# EAGLE design untitled (EAGLE 7.2.0)
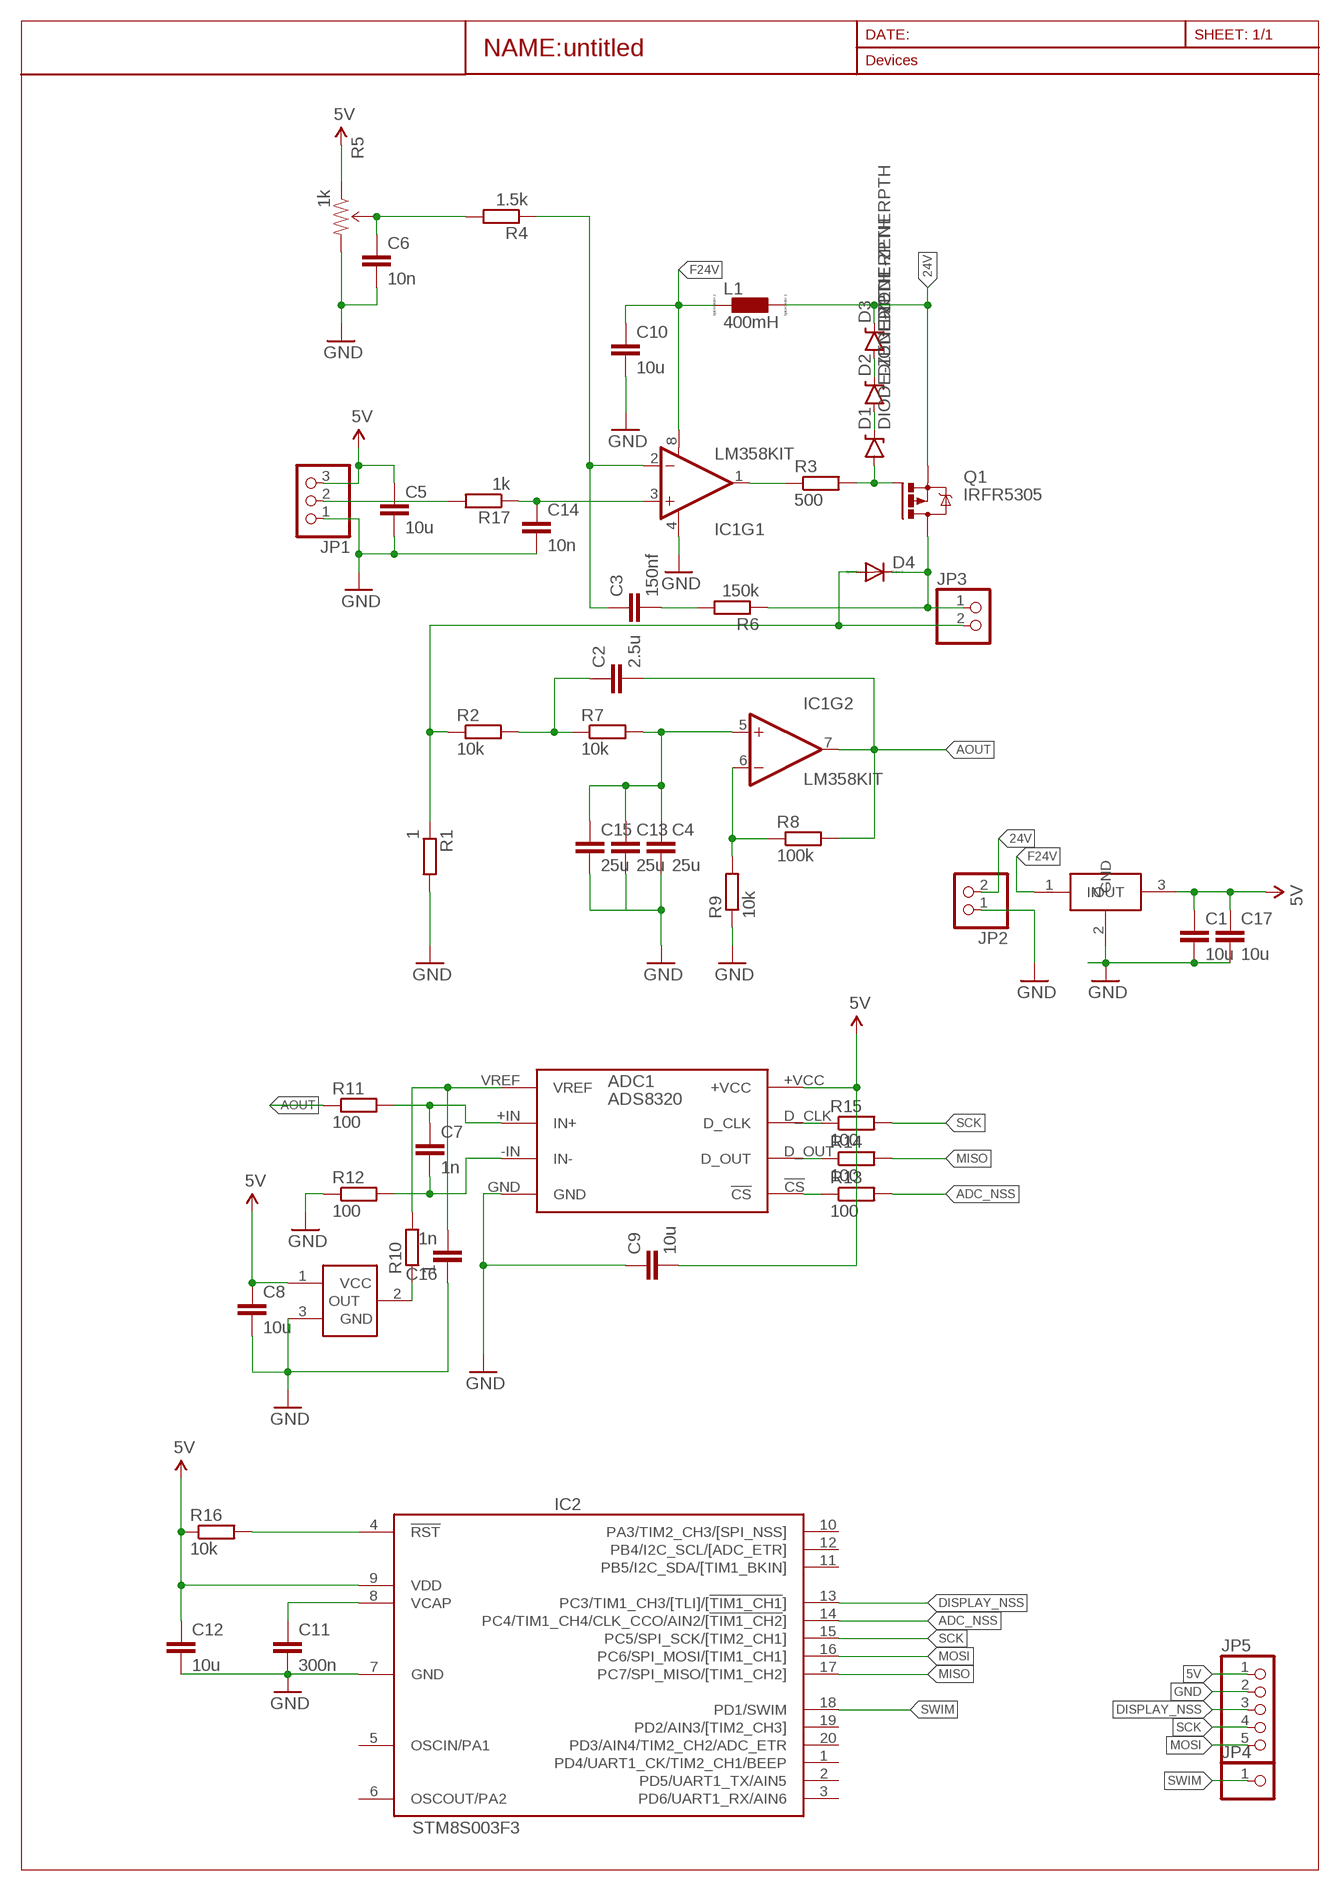
[diagram p0: schematic, sheet 1]

## Parts
ADC1  ADS8320  [S-PDSO-G8]
C1  10u  CC0805  [C0805]
C2  2.5u  CC0805  [C0805]
C3  150nf  CC0805  [C0805]
C4  25u  CC0805  [C0805]
C5  10u  CC0805  [C0805]
C6  10n  CC0805  [C0805]
C7  1n  CC0805  [C0805]
C8  10u  CC0805  [C0805]
C9  10u  CC0805  [C0805]
C10  10u  CC0805  [C0805]
C11  300n  CC0805  [C0805]
C12  10u  CC0805  [C0805]
C13  25u  CC0805  [C0805]
C14  10n  CC0805  [C0805]
C15  25u  CC0805  [C0805]
C16  1n  CC0805  [C0805]
C17  10u  CC0805  [C0805]
D1  DIODE-ZENERPTH  [DIODE-ZENER]
D2  DIODE-ZENERPTH  [DIODE-ZENER]
D3  DIODE-ZENERPTH  [DIODE-ZENER]
D4  DIODE-MINIMELF  [MINIMELF]
IC1  LM358KIT  [DIP08-KIT]
IC2  STM8S003F3  [TSSOP20]
JP1  PINHD-1X3  [1X03]
JP2  PINHD-1X02_2.54  [1X02]
JP3  PINHD-1X02_2.54  [1X02]
JP4  PINHD-1X01_2.54  [1X01]
JP5  PINHD-1X05_2.54  [1X05]
L1  400mH  LL5650M  [L5650M]
Q1  IRFR5305  [D-PAK_TO252AA]
R1  1  R0805  [R0805]
R2  10k  R0805  [R0805]
R3  500  R0805  [R0805]
R4  1.5k  R0805  [R0805]
R5  1k  TRIMPOTTRIMPOT_PTH_S3_LOCK  [TRIMPOT_PTH_S3_LOCK]
R6  150k  R0805  [R0805]
R7  10k  R0805  [R0805]
R8  100k  R0805  [R0805]
R9  10k  R0805  [R0805]
R10  1  R0805  [R0805]
R11  100  R0805  [R0805]
R12  100  R0805  [R0805]
R13  100  R0805  [R0805]
R14  100  R0805  [R0805]
R15  100  R0805  [R0805]
R16  10k  R0805  [R0805]
R17  1k  R0805  [R0805]
U$1  REF3025  [SOT23]
U$2  L7805C2T  [D2PACK]

## Nets
5V: ADC1.+VCC C1.1 C5.1 C8.1 C9.2 C12.1 C17.1 IC2.9(VDD) JP1.3 JP5.1 R5.1(CCW) R16.1 U$1.1(VCC) U$2.3(OUT)
24V: D3.P$1(C) JP2.2 L1.1 Q1.3(S)
ADC_NSS: IC2.14(PC4/TIM1_CH4/CLK_CCO/AIN2/[!TIM1_CH2!]) R13.2
AOUT: C2.2 IC1.7(OUT) R8.2 R11.1
DISPLAY_NSS: IC2.13(PC3/TIM1_CH3/[TLI]/[!TIM1_CH1!]) JP5.3
F24V: C10.1 IC1.8(V+) L1.2 U$2.1(IN)
GND: ADC1.GND C1.2 C4.2 C5.2 C6.2 C8.2 C9.1 C10.2 C11.2 C12.2 C13.2 C14.2 C15.2 C16.1 C17.2 IC1.4(V-) IC2.7(GND) JP1.1 JP2.1 JP5.2 R1.2 R5.3(CW) R9.1 R12.1 U$1.3(GND) U$2.2(GND)
MISO: IC2.17(PC7/SPI_MISO/[TIM1_CH2]) R14.2
MOSI: IC2.16(PC6/SPI_MOSI/[TIM1_CH1]) JP5.5
N$1: IC1.1(OUT) R3.1
N$2: C3.2 R6.2
N$3: D4.C JP3.1 Q1.4(D) R6.1
N$4: C14.1 IC1.3(+IN) R17.1
N$5: C3.1 IC1.2(-IN) R4.1
N$6: C6.1 R4.2 R5.2(WIPER)
N$7: D4.A JP3.2 R1.1 R2.1
N$9: C2.1 R2.2 R7.1
N$10: D1.P$2(A) Q1.1(G) R3.2
N$11: C4.1 C13.1 C15.1 IC1.5(+IN) R7.2
N$12: R10.1 U$1.2(OUT)
N$13: IC1.6(-IN) R8.1 R9.2
N$14: ADC1.VREF C16.2 R10.2
N$15: D2.P$1(C) D3.P$2(A)
N$16: D1.P$1(C) D2.P$2(A)
N$17: ADC1.-IN(IN-) C7.2 R12.2
N$18: ADC1.+IN(IN+) C7.1 R11.2
N$20: C11.1 IC2.8(VCAP)
N$21: ADC1.D_CLK R15.1
N$22: ADC1.D_OUT R14.1
N$23: ADC1.!CS R13.1
N$25: IC2.4(!RST) R16.2
N$27: JP1.2 R17.2
SCK: IC2.15(PC5/SPI_SCK/[TIM2_CH1]) JP5.4 R15.2
SWIM: IC2.18(PD1/SWIM) JP4.1
Unconnected: IC2.1(PD4/UART1_CK/TIM2_CH1/BEEP) IC2.2(PD5/UART1_TX/AIN5) IC2.3(PD6/UART1_RX/AIN6) IC2.5(OSCIN/PA1) IC2.6(OSCOUT/PA2) IC2.10(PA3/TIM2_CH3/[SPI_NSS]) IC2.11(PB5/I2C_SDA/[TIM1_BKIN]) IC2.12(PB4/I2C_SCL/[ADC_ETR]) IC2.19(PD2/AIN3/[TIM2_CH3]) IC2.20(PD3/AIN4/TIM2_CH2/ADC_ETR)

## Library data of the parts
ADC1 = ADC:ADS8320
C1-C17 = smalsmd:C: Capacitor
D1-D3 = SparkFun-DiscreteSemi:DIODE-ZENER: Zener Diode Production Part - 8199 3.4V Zener Voltage
D4 = diode:DIODE-: DIODE
IC1 = SparkFun-AnalogIC:LM358: Jellybean op-amp; PROD_ID: IC-09172
IC2 = stm8:STM8S003: Value line, 16 MHz STM8S 8-bit MCU, 8 Kbytes Flash, 128 bytes data EEPROM, 10-bit ADC, 3 timers, UART, SPI, I2C
JP1 = pinhead:PINHD-1X3: PIN HEADER
JP2 JP3 = pinhead-2:PINHD-1X02: PIN HEADER
JP4 = pinhead-2:PINHD-1X01: PIN HEADER
JP5 = pinhead-2:PINHD-1X05: PIN HEADER
L1 = eagle-ltspice:L: INDUCTOR, European symbol; SPICEMODEL: NONE; SPICEPREFIX: L
Q1 = transistor-power:IRF?5305: HEXFET Power MOSFET Source: http://www.irf.com/product-info/datasheets/data/irfr5305pbf.pdf
R1-R4 R6-R17 = smalsmd:R
R5 = Electromechanical:TRIMPOT: Various small potentiometers for "set-and-forget" applications
U$1 = ADC:REF3025
U$2 = stabil:L7805C2T

## Board
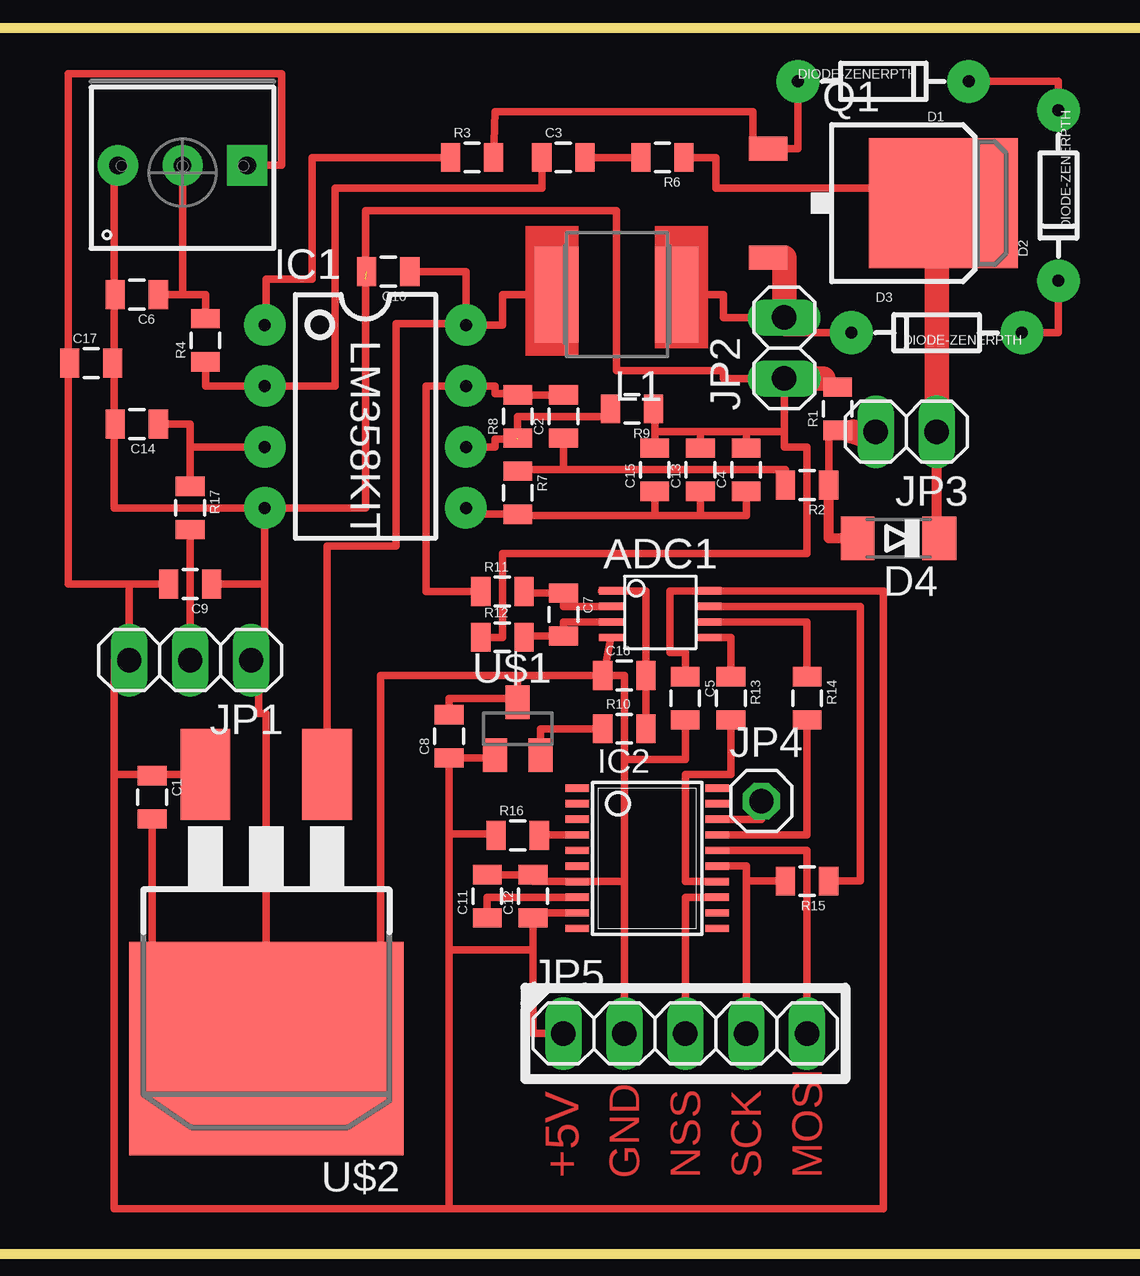
[diagram p1: board, top side]

No outline drawn. Coordinates in mm, seen from the top.
Copper layers (1*16): Top 0.035mm / dielectric 1.5mm / Bottom 0.035mm
Design rules "default": minimum track width 10mil, minimum drill 24mil, track to track 8mil, track to pad 8mil, pad to pad 8mil, via to via 8mil, smd to smd 8mil, copper to edge 40mil, drill to drill 8mil, minimum pad ring 10mil, minimum via ring 8mil, stop-mask expansion 4mil, vias tented up to drill 0mil, thermal gap 10mil
Milling: 4 lines

### Footprints (pad centres in the part's own frame; a part is rotated, then mirrored left to right if it is on the bottom)
S-PDSO-G8 = smd 1 x 0.305: !CS 3.55,-2.55; +IN -0.55,-1.25; +VCC 3.55,-0.6; -IN -0.55,-1.9; D_CLK 3.55,-1.25; D_OUT 3.55,-1.9; GND -0.55,-2.55; VREF -0.55,-0.6
C0805 = smd 0.8 x 1.2: 1 -0.9,0; 2 0.9,0
DIODE-ZENER = drill 0.5 pad 1.778: P$1 -3.556,0; P$2 3.556,0
MINIMELF = smd 1.4 x 1.8: A 1.7,0; C -1.7,0
DIP08-KIT = drill 0.5 pad 1.727: 1 -3.81,-4.191; 2 -1.27,-4.191; 3 1.27,-4.191; 4 3.81,-4.191; 5 3.81,4.191; 6 1.27,4.191; 7 -1.27,4.191; 8 -3.81,4.191
TSSOP20 = smd 0.305 x 0.991: 1 -2.925,-2.918; 2 -2.275,-2.918; 3 -1.625,-2.918; 4 -0.975,-2.918; 5 -0.325,-2.918; 6 0.325,-2.918; 7 0.975,-2.918; 8 1.625,-2.918; 9 2.275,-2.918; 10 2.925,-2.918; 11 2.925,2.918; 12 2.275,2.918; 13 1.625,2.918; 14 0.975,2.918; 15 0.325,2.918; 16 -0.325,2.918; 17 -0.975,2.918; 18 -1.625,2.918; 19 -2.275,2.918; 20 -2.925,2.918
1X03 = drill 1.016 long: 1 -2.54,0; 2 0,0; 3 2.54,0
1X02 = drill 1.016 long: 1 -1.27,0; 2 1.27,0
1X01 = drill 1.016 octagon: 1 0,0
1X05 = drill 1.016 long: 1 -5.08,0; 2 -2.54,0; 3 0,0; 4 2.54,0; 5 5.08,0
L5650M = smd 1.8 x 4: 1 -2.5,0; 2 2.5,0
D-PAK_TO252AA = smd 1 x 1.6: 1 -2.28,-4.8; 3 2.28,-4.8 | smd 5.4 x 6.2: 4 0,2.5
R0805 = smd 0.8 x 1.2: 1 -0.9,0; 2 0.9,0
TRIMPOT_PTH_S3_LOCK = drill 0.737 pad 1.676 square: 1 -2.692,-0.305 | drill 0.737 pad 1.676: 2 0,-0.305; 3 2.692,-0.305
SOT23 = smd 1 x 1.4: 1 -0.95,-1.1; 2 0.95,-1.1; 3 0,1.1
D2PACK = smd 2.083 x 3.81: 1 -2.54,-8.89; 3 2.54,-8.89 | smd 11.43 x 8.89: 2 0,2.54

### Placement (x,y rotation side)
ADC1  27.62,28.26 0 top
C1  7.94,19.05 270 top
C2  25.08,34.92 90 top
C3  25.08,45.72 0 top
C4  32.7,32.7 90 top
C5  30.16,23.18 270 top
C6  7.3,40.01 180 top
C7  25.08,26.67 270 top
C8  20.32,21.59 90 top
C9  9.53,27.94 180 top
C10  17.78,40.96 180 top
C11  21.91,14.92 90 top
C12  23.81,14.92 90 top
C13  30.8,32.7 90 top
C14  7.3,34.61 180 top
C15  28.89,32.7 90 top
C16  27.62,24.13 0 top
C17  5.4,37.15 0 top
D1  38.42,48.9 180 top
D2  45.72,44.13 90 top
D3  40.64,38.42 0 top
D4  39.05,29.84 180 top
IC1  16.83,34.92 270 top
IC2  28.57,16.51 270 top
JP1  9.53,24.77 180 top
JP2  34.29,37.78 90 top
JP3  39.37,34.29 180 top
JP4  33.34,18.89 0 top
JP5  30.16,9.21 0 top
L1  27.3,40.01 180 top
Q1  38.42,43.81 270 top
R1  36.51,35.24 90 top
R2  35.24,32.07 180 top
R3  21.27,45.72 0 top
R4  10.16,38.1 90 top
R5  9.21,45.09 180 top
R6  29.21,45.72 180 top
R7  23.18,31.75 270 top
R8  23.18,34.92 90 top
R9  27.94,35.24 180 top
R10  27.62,21.91 0 top
R11  22.54,27.62 0 top
R12  22.54,25.72 0 top
R13  32.07,23.18 270 top
R14  35.24,23.18 270 top
R15  35.24,15.56 180 top
R16  23.18,17.46 0 top
R17  9.53,31.11 270 top
U$1  23.18,21.91 0 top
U$2  12.7,11.11 180 top

### Tracks (layer width: path | path; a pad name or v marks a point on that pad's centre or on a via)
5V
  Top 0.305: 6.99,27.94 JP1.3 6.35,24.77 6.35,20 | 6.99,27.94 4.45,27.94 4.45,37.15 | 4.45,37.15 4.45,49.21 13.34,49.21 13.34,45.4 R5.1 | U$1.1 | U$1.1 22.23,20.69 C8.1 20.32,17.52 | U$1.1 22.54,20.81 | 30.16,24.13 C5.1 30.16,25.08 29.53,25.08 29.53,27.66 ADC1.+VCC 38.42,27.66 38.42,1.91 20.32,1.91 | 20.32,17.52 20.32,12.7 | 20.32,12.7 20.32,1.91 | 20.32,1.91 6.35,1.91 6.35,20 | 6.35,20 7.94,20 | 7.94,20 U$2.3 | C9.2 6.99,27.94 | C1.1 7.94,20 | R16.1 22.23,17.52 20.32,17.52 | IC2.9 23.81,14.23 C12.1 23.81,12.7 | 23.81,12.7 20.32,12.7 | JP5.1 23.81,9.21 23.81,12.7 | C17.1 4.45,37.15
24V
  Top 0.305: D3.P$1 34.29,38.42 JP2.2 31.75,39.05 31.75,40.01 L1.1
  Top 1.016: Q1.3 34.29,41.53 JP2.2
ADC_NSS
  Top 0.305: R13.2 32.07,20 30.16,20 30.16,15.54 IC2.14
AOUT
  Top 0.305: C2.2 R8.2 23.18,35.88 22.23,35.88 22.23,36.2 IC1.7 19.37,36.2 19.37,27.62 R11.1
DISPLAY_NSS
  Top 0.305: IC2.13 30.16,14.88 JP5.3
F24V
  Top 0.305: IC1.8 21.02,38.79 18.1,38.79 18.1,29.53 15.24,29.53 U$2.1 | C10.1 21.02,40.96 IC1.8 | L1.2 22.54,40.01 22.54,38.73 IC1.8
GND  (1 unrouted)
  Top 0.305: IC1.4 12.64,27.94 | 12.64,27.94 12.64,24.77 12.38,24.77 | 12.38,24.77 JP1.1 | 35.93,36.51 R1.2 | IC1.4 16.83,31.11 16.83,40.64 | 12.38,24.77 12.38,22.54 12.7,22.54 12.7,11.75 | ADC1.GND 26.75,24.13 | 26.75,24.13 C16.1 23.18,24.13 | U$1.3 23.18,23.18 | 23.18,23.18 20.32,23.18 C8.2 | 23.18,23.18 23.18,24.13 | 26.75,24.13 27.62,24.13 27.62,20.64 | 27.62,20.64 30.16,20.64 C5.2 | R12.1 22.54,25.72 22.54,29.21 35.24,29.21 35.24,33.66 34.29,33.66 34.29,34.29 | 32.7,33.66 C4.2 | 34.29,34.29 JP2.1 31.75,36.51 31.75,36.83 27.3,36.83 27.3,43.5 16.83,43.5 16.83,40.96 C10.2 | 12.7,11.75 U$2.2 | 23.18,24.13 17.46,24.13 17.46,11.75 12.7,11.75 | C9.1 12.64,27.94 | C1.2 7.94,11.75 12.7,11.75 | 27.62,15.54 IC2.7 23.81,15.54 C12.2 C11.2 | 27.62,15.54 27.62,20.64 | JP5.2 27.62,15.54 | R5.3 6.35,45.39 6.35,39.69 | 6.35,39.69 6.35,37.15 | 6.35,37.15 6.35,34.61 | IC1.4 6.35,31.11 6.35,34.61 | C14.2 6.35,34.61 | C6.2 6.35,39.69 | C17.2 6.35,37.15 | R9.1 28.89,35.24 28.89,34.29 | 28.89,34.29 C15.2 | C13.2 30.8,34.29 | 30.8,34.29 28.89,34.29 | 32.7,34.29 30.8,34.29 | 32.74,33.6 C4.2 | C4.2 32.7,34.29 | 32.7,34.29 34.29,34.29
  Top 1.016: JP2.1 35.93,36.51
MISO
  Top 0.305: IC2.17 35.24,17.48 R14.2
MOSI
  Top 0.305: IC2.16 35.24,16.84 JP5.5
N$1
  Top 0.305: IC1.1 12.7,38.73 12.7,40.64 14.61,40.64 14.61,45.72 R3.1
N$2
  Top 0.305: C3.2 R6.2
N$3
  Top 0.305: 40.6,43.18 Q1.4 41.23,44.45 31.43,44.45 31.43,45.72 R6.1 | 40.6,43.18 40.32,43.18 | 40.6,43.18 40.64,43.18
  Top 0.406: D4.C 40.64,29.84 JP3.1
  Top 1.016: 40.64,43.18 JP3.1
N$4
  Top 0.305: IC1.3 9.53,33.66 | 9.53,33.66 R17.1 | C14.1 9.53,34.61 9.53,33.66
N$5
  Top 0.305: C3.1 24.18,44.45 15.56,44.45 15.56,36.2 IC1.2 10.16,36.2 R4.1
N$6
  Top 0.305: R5.2 9.21,40.01 | C6.1 9.21,40.01 | 9.21,40.01 10.16,40.01 R4.2
N$7
  Top 0.305: 37.15,34.29 36.51,34.29 R1.1 36.14,34.34 R2.1
  Top 0.406: D4.A 36.14,29.84 R2.1
  Top 1.016: JP3.2 38.1,33.97 37.15,34.29
N$9
  Top 0.305: C2.1 25.08,32.7 | 25.08,32.7 23.18,32.7 R7.1 | 25.08,32.7 34.34,32.7 R2.2
N$10
  Top 0.305: R3.2 22.23,47.62 32.98,47.62 32.98,46.04 Q1.1 34.86,46.09 D1.P$2
N$11
  Top 0.305: IC1.5 21.02,30.85 R7.2 23.18,30.8 28.89,30.8 | 28.89,30.8 C15.1 | C13.1 30.8,30.8 | 30.8,30.8 28.89,30.8 | C4.1 32.7,30.8 30.8,30.8
N$12
  Top 0.305: R10.1 24.13,21.91 U$1.2
N$13  (1 unrouted)
  Top 0.305: 23.18,33.97 22.23,33.97 22.23,33.66 IC1.6 | R8.1 23.18,34.92 27.04,34.92 R9.2
N$14
  Top 0.305: 26.67,27.66 ADC1.VREF 28.52,27.66 C16.2 R10.2
N$15
  Top 0.305: D3.P$2 45.72,38.42 D2.P$1
N$16
  Top 0.305: D1.P$1 45.72,48.9 D2.P$2
N$17
  Top 0.305: R12.2 23.44,25.77 C7.2 25.08,26.36 ADC1.-IN
N$18
  Top 0.305: ADC1.+IN 25.08,27.01 C7.1 23.44,27.57 R11.2
N$19  (via drill 0.1 pad 1.42)
  other vias: 33.34,18.89
N$20
  Top 0.305: C11.1 21.91,14.88 IC2.8
N$21
  Top 0.305: ADC1.D_CLK 37.47,27.01 37.47,15.56 R15.1
N$22
  Top 0.305: ADC1.D_OUT 35.24,26.36 R14.1
N$23
  Top 0.305: ADC1.!CS 32.07,25.71 R13.1
N$25
  Top 0.305: R16.2 23.81,17.48 IC2.4
N$27
  Top 0.305: JP1.2 R17.2
SCK
  Top 0.305: 32.7,15.56 JP5.4 | IC2.15 32.7,16.18 32.7,15.56 | 32.7,15.56 R15.2
SWIM
  Top 0.305: IC2.18 33.34,18.14 JP4.1
(copper drawn outside any net)
  shapes: Top area x2

### Text on the board
Top: +5V | GND | NSS | SCK | MOSI